# EAGLE design UWB-Breakout (EAGLE 9.6.1)
CNAME: DWM1000 Breakout; CREVISION: 1.0; DESIGNER: Jedidiah Hodson
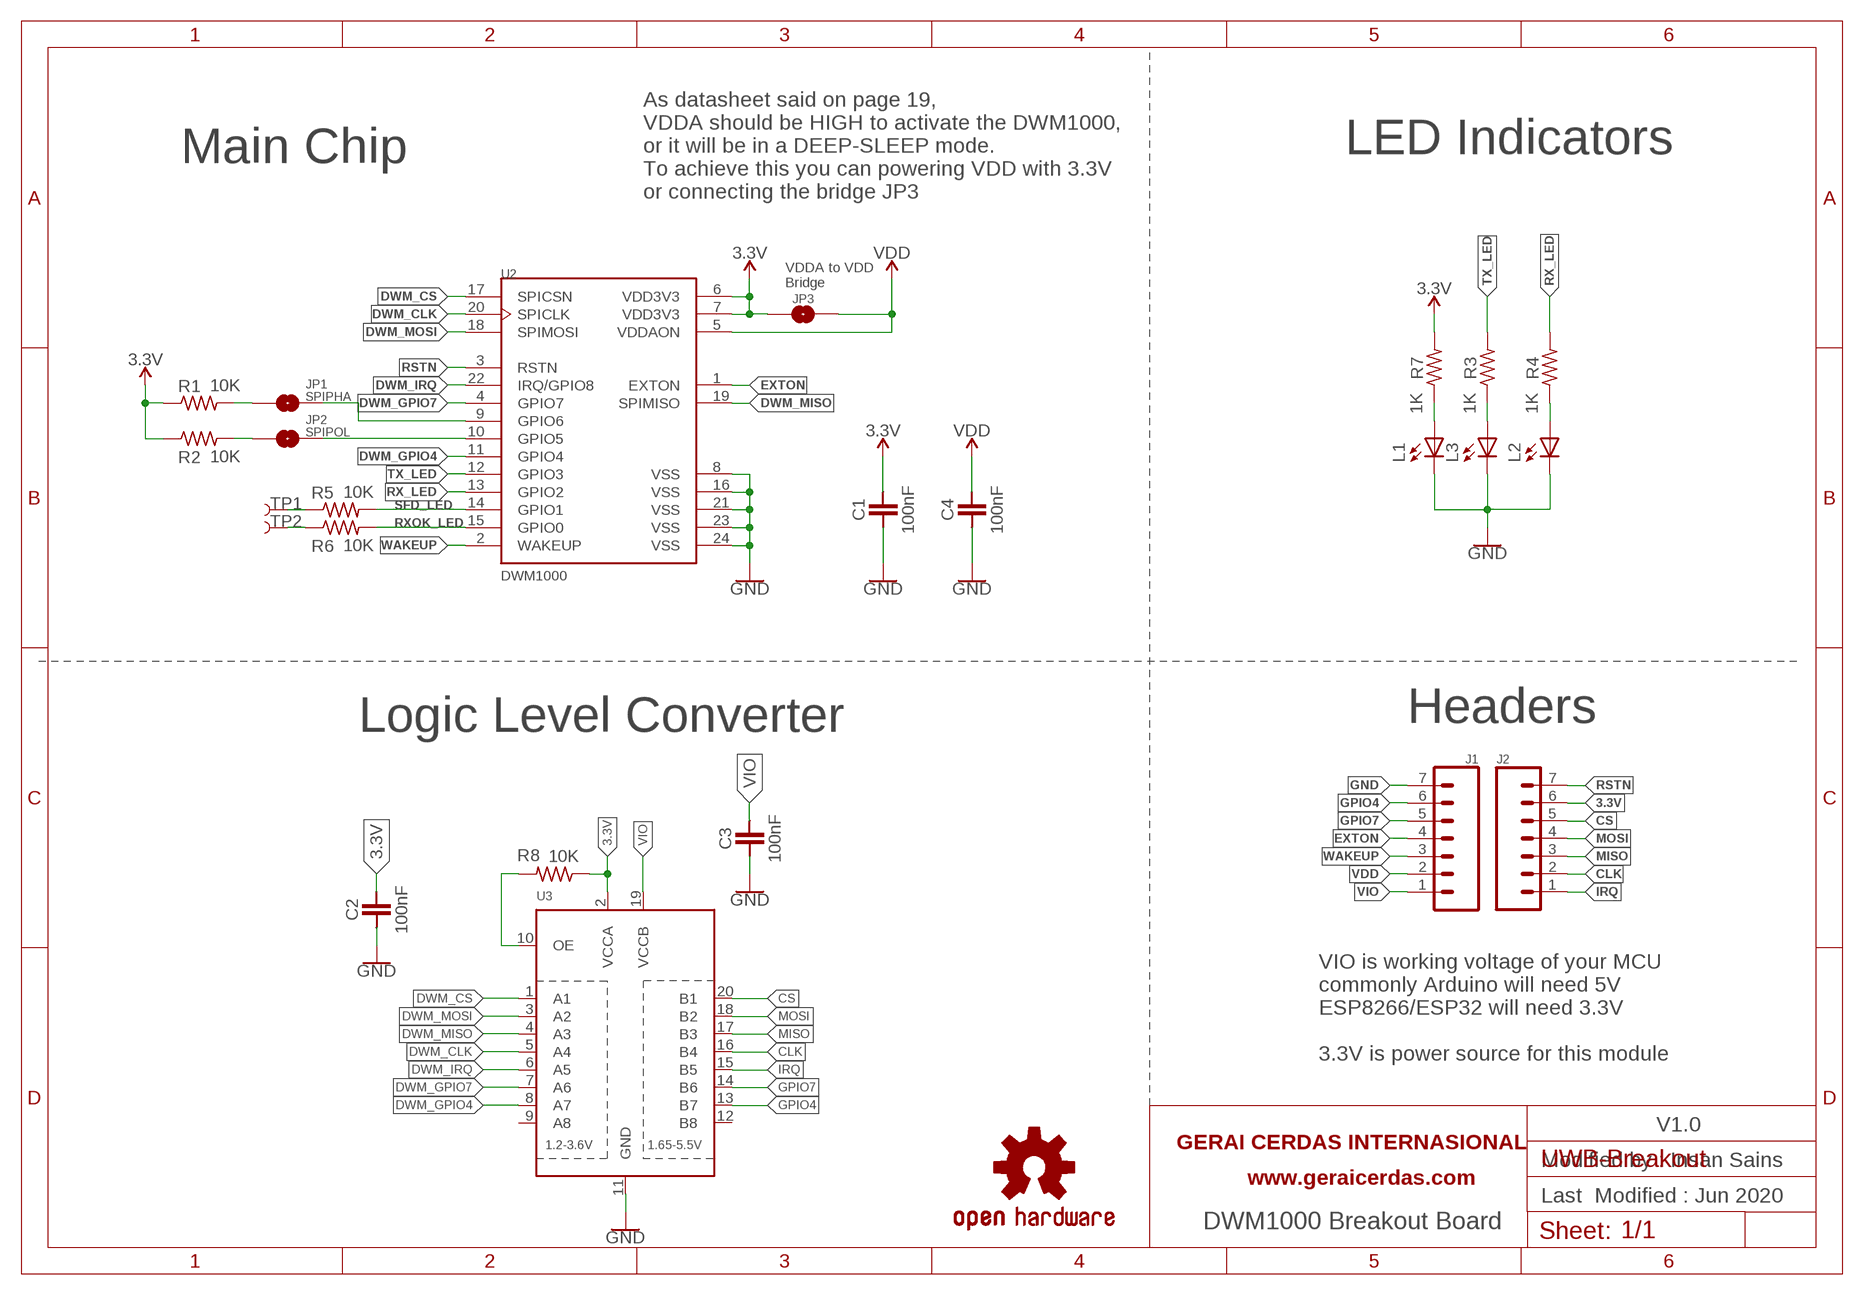
[diagram p0: schematic, sheet 1]

## Parts
C1  100nF  CAPACITOR-SMD0603  [C0603]
C2  100nF  CAPACITOR-SMD0603  [C0603]
C3  100nF  CAPACITOR-SMD0603  [C0603]
C4  100nF  CAPACITOR-SMD0603  [C0603]
FRAME1  FRAME  [A4-HOR]
J1  CONN_07NO_SILK  [1X07_NO_SILK]
J2  CONN_07NO_SILK  [1X07_NO_SILK]
JP1  SPIPHA  JUMPER-SMT_2_NO_SILK  [SMT-JUMPER_2_NO_SILK]
JP2  SPIPOL  JUMPER-SMT_2_NO_SILK  [SMT-JUMPER_2_NO_SILK]
JP3  JUMPER-SMT_2_NO_SILK  [SMT-JUMPER_2_NO_SILK]
L1  LED-SMD0805  [LED0805]
L2  LED-SMD0805  [LED0805]
L3  LED-SMD0805  [LED0805]
LOGO1  OSHW-LOGOM  [OSHW-LOGO-M]
R1  10K  RESISTOR-SMD0603  [R0603]
R2  10K  RESISTOR-SMD0603  [R0603]
R3  1K  RESISTOR-SMD0603  [R0603]
R4  1K  RESISTOR-SMD0603  [R0603]
R5  10K  RESISTOR-SMD0603  [R0603]
R6  10K  RESISTOR-SMD0603  [R0603]
R7  1K  RESISTOR-SMD0603  [R0603]
R8  10K  RESISTOR-SMD0603  [R0603]
TP1  TEST-POINT3X5  [PAD.03X.05]
TP2  TEST-POINT3X5  [PAD.03X.05]
U2  DWM1000  [XCVR_DWM1000]
U3  TXB0108PWR  [TSSOP20]

## Nets
3.3V: C1.2 C2.2 J2.6 JP3.1 R1.1 R2.1 R7.2 R8.1 U2.6(VDD3V3) U2.7(VDD3V3) U3.2(VCCA)
CLK: J2.2 U3.16(B4)
CS: J2.5 U3.20(B1)
DWM_CLK: U2.20(SPICLK) U3.5(A4)
DWM_CS: U2.17(SPICSN) U3.1(A1)
DWM_GPIO4: U2.11(GPIO4) U3.8(A7)
DWM_GPIO7: U2.4(GPIO7) U3.7(A6)
DWM_IRQ: U2.22(IRQ/GPIO8) U3.6(A5)
DWM_MISO: U2.19(SPIMISO) U3.4(A3)
DWM_MOSI: U2.18(SPIMOSI) U3.3(A2)
EXTON: J1.4 U2.1(EXTON)
GND: C1.1 C2.1 C3.1 C4.1 J1.7 L1.C L2.C L3.C U2.8(VSS) U2.16(VSS) U2.21(VSS) U2.23(VSS) U2.24(VSS) U3.11(GND)
GPIO4: J1.6 U3.13(B7)
GPIO7: J1.5 U3.14(B6)
IRQ: J2.1 U3.15(B5)
MISO: J2.3 U3.17(B3)
MOSI: J2.4 U3.18(B2)
N$1: L1.A R7.1
N$2: L3.A R3.1
N$3: JP1.2 U2.9(GPIO6)
N$4: JP2.2 U2.10(GPIO5)
N$5: JP1.1 R1.2
N$6: JP2.1 R2.2
N$7: R6.1 TP2.P$1
N$8: R5.1 TP1.P$1
N$9: L2.A R4.1
N$10: R8.2 U3.10(OE)
RSTN: J2.7 U2.3(RSTN)
RX_LED: R4.2 U2.13(GPIO2)
RXOK_LED: R6.2 U2.15(GPIO0)
SFD_LED: R5.2 U2.14(GPIO1)
TX_LED: R3.2 U2.12(GPIO3)
VDD: C4.2 J1.2 JP3.2 U2.5(VDDAON)
VIO: C3.2 J1.1 U3.19(VCCB)
WAKEUP: J1.3 U2.2(WAKEUP)
Unconnected: U3.9(A8) U3.12(B8)

## Notes on the sheet
- Main Chip | LED Indicators
- As datasheet said on page 19, 
  VDDA should be HIGH to activate the DWM1000,
  or it will be in a DEEP-SLEEP mode.
  To achieve this you can powering VDD with 3.3V
  or connecting the bridge JP3
- VDDA to VDD
  Bridge
- Logic Level Converter | Headers
- VIO is working voltage of your MCU
  commonly Arduino will need 5V
  ESP8266/ESP32 will need 3.3V
  
  3.3V is power source for this module
- V1.0
- Modified by : Insan Sains
- Last  Modified : Jun 2020
- DWM1000 Breakout Board

## Library data of the parts
C1-C4 = geraicerdas:CAPACITOR
FRAME1 = geraicerdas:FRAME
J1 J2 = SparkFun-Connectors:CONN_07: Multi connection point. Often used as Generic Header-pin footprint for 0.1 inch spaced/style header connections On any of the 0.1 inch spaced packages, you can populate with these: Break Away Headers - Straight <https://www.sparkfun.com/products/116> (PRT-00116) Break Away Male Headers - Right Angle <https://www.sparkfun.com/products/553> (PRT-00553) Female Headers <https://www.sparkfun.com/products/115> (PRT-00115) Break Away Headers - Machine Pin <https://www.sparkfun.com/products/117> (PRT-00117) Break Away Female Headers - Swiss Machine Pin <https://www.sparkfun.com/products/743> (PRT-00743) For SCREWTERMINALS and SPRING TERMINALS visit here: Screw Terimnals on SparkFun.com <https://www.sparkfun.com/search/results?term=Screw+Terminals> (5mm/3.5mm/2.54mm spacing) This device is also useful as a general connection point to wire up your design to another part of your project. Our various solder wires solder well into these plated through hole pads. Hook-Up Wire - Assortment (Stranded, 22 AWG) <https://www.sparkfun.com/products/11375> (PRT-11375) Hook-Up Wire - Assortment (Solid Core, 22 AWG) <https://www.sparkfun.com/products/11367> (PRT-11367) View the entire wire category on our website here <https://www.sparkfun.com/categories/141> Special notes: Molex polarized connector foot print use with SKU : PRT-08231 with associated crimp pins and housings. 1MM SMD Version SKU: PRT-10208 NOTES ON THE VARIANTS LOCK and LOCK_LONGPADS... This footprint was designed to help hold the alignment of a through-hole component (i.e. 6-pin header) while soldering it into place. You may notice that each hole has been shifted either up or down by 0.005 of an inch from it's more standard position (which is a perfectly straight line). This slight alteration caused the pins (the squares in the middle) to touch the edges of the holes. Because they are alternating, it causes a "brace" to hold the component in place. 0.005 has proven to be the perfect amount of "off-center" position when using our standard breakaway headers. Although looks a little odd when you look at the bare footprint, once you have a header in there, the alteration is very hard to notice. Also,if you push a header all the way into place, it is covered up entirely on the bottom side.
JP1-JP3 = SparkFun-Jumpers:JUMPER-SMT_2_NO: Normally open jumper This jumper has two pads in close proximity to each other. Apply solder to close the connection. Round pads are easier to solder for beginners, but are a lot larger. SparkFun Product that uses the round pads: SparkFun EL Sequencer <https://www.sparkfun.com/products/12781>
L1-L3 = geraicerdas:LED
LOGO1 = SparkFun-Aesthetics:OSHW-LOGO: Open-Source Hardware (OSHW) Logo This logo indicates the piece of hardware it is found on incorporates a OSHW license and/or adheres to the definition of open source hardware found here: http://freedomdefined.org/OSHW
R1-R8 = geraicerdas:RESISTOR
TP1 TP2 = SparkFun-Connectors:TEST-POINT: SparkFun Test Points Bare copper test points for troubleshooting or In-Circuit-Testing. These are used by our Production team for verifying production board runs using pogo-pins on test beds. SparkFun Products: SparkFun LSM9DS1 Breakout <https://www.sparkfun.com/products/13284> SparkFun PSOC <https://www.sparkfun.com/products/13714> SparkFun Load Cell Amplifier <https://www.sparkfun.com/products/13879>
U2 = DWM1000:DWM1000: Mod Ieee802.15.4-2011 Uwb Txrx; AVAILABILITY: Unavailable; DESCRIPTION: Mod Ieee802.15.4-2011 Uwb Txrx; MF: Decawave Limited; MP: DWM1000; PACKAGE: Module Decawave; PRICE: None
U3 = geraicerdas:TXB0108: 8-Bit Bi-Directional Level Shifter 1.2V-3.6V (VCCA) to 1.65V-5.5V (VCCB) bi-directional level shifter with auto direction sensing. Max data rate - VCCA 1.8V: 20Mbps (50ns), VCCA 3.3V: 100Mbps (10ns) Digikey: 296-21527-1-ND

## Board
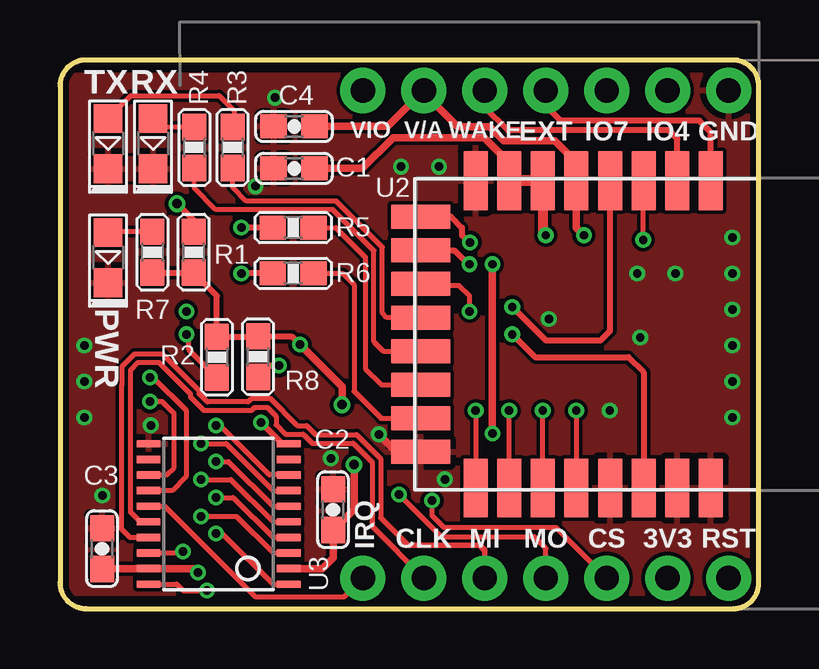
[diagram p1: board, top side]
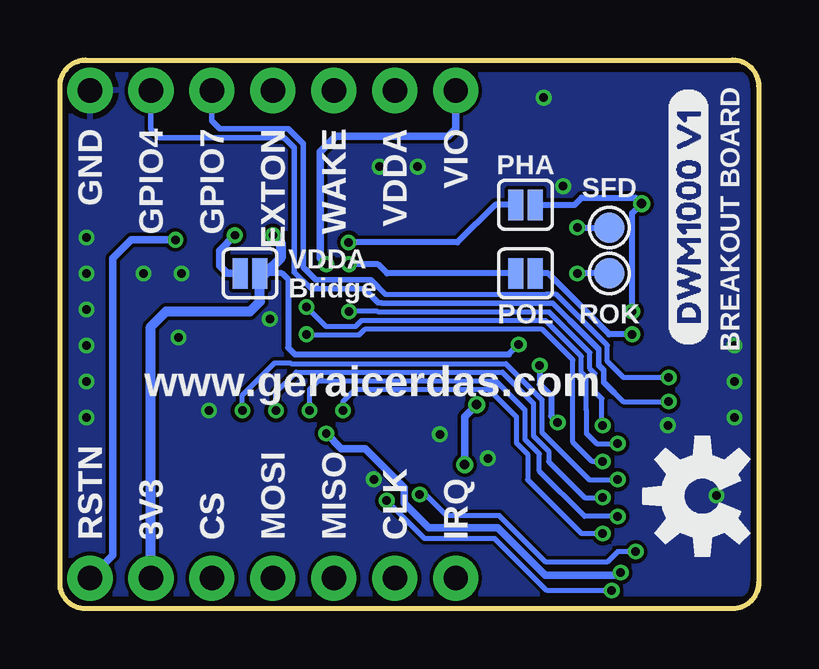
[diagram p2: board, bottom side, seen from below]

Size 29.11 x 22.86 mm. Coordinates in mm from the lower left corner, seen from the top.
Outline: 28.05,22.86 1.08,22.86 arc90 0,21.78 0,1.08 arc90 1.08,0 28.06,0 arc90 29.11,1.05 29.11,21.78 arc90 28.05,22.86
Copper layers (1*16): Top 0.035mm / dielectric 1.5mm / Bottom 0.035mm
Design rules "GeraiCerdas_DRU": minimum track width 6mil, minimum drill 12mil, track to track 6mil, track to pad 6mil, pad to pad 6mil, via to via 6mil, smd to smd 0mil, copper to edge 10mil, drill to drill 10mil, minimum pad ring 10mil, minimum via ring 6mil, stop-mask expansion 2mil, vias tented up to drill 100mil, thermal gap 10mil

### Footprints (pad centres in the part's own frame; a part is rotated, then mirrored left to right if it is on the bottom)
C0603 = smd 1.1 x 1: 1 -0.85,0; 2 0.85,0
1X07_NO_SILK = drill 1.016 pad 1.88: 1 0,0; 2 2.54,0; 3 5.08,0; 4 7.62,0; 5 10.16,0; 6 12.7,0; 7 15.24,0
SMT-JUMPER_2_NO_SILK = smd 0.635 x 1.27: 1 -0.406,0; 2 0.406,0
LED0805 = smd 1.2 x 1.2: A 0,-1.05; C 0,1.05
R0603 = smd 1.1 x 1: 1 -0.85,0; 2 0.85,0
PAD.03X.05 = smd 1.27 x 1.27: P$1 0,0
XCVR_DWM1000 = smd 2.45 x 1: 1 -6.4,1.8; 2 -6.4,0.4; 3 -6.4,-1; 4 -6.4,-2.4; 5 -6.4,-3.8; 6 -6.4,-5.2; 7 -6.4,-6.6; 8 -6.4,-8; 17 6.4,-8; 18 6.4,-6.6; 19 6.4,-5.2; 20 6.4,-3.8; 21 6.4,-2.4; 22 6.4,-1; 23 6.4,0.4; 24 6.4,1.8 | smd 1 x 2.45: 9 -4.9,-10.295; 10 -3.5,-10.295; 11 -2.1,-10.295; 12 -0.7,-10.295; 13 0.7,-10.295; 14 2.1,-10.295; 15 3.5,-10.295; 16 4.9,-10.295
TSSOP20 = smd 0.305 x 0.991: 1 -2.925,-2.918; 2 -2.275,-2.918; 3 -1.625,-2.918; 4 -0.975,-2.918; 5 -0.325,-2.918; 6 0.325,-2.918; 7 0.975,-2.918; 8 1.625,-2.918; 9 2.275,-2.918; 10 2.925,-2.918; 11 2.925,2.918; 12 2.275,2.918; 13 1.625,2.918; 14 0.975,2.918; 15 0.325,2.918; 16 -0.325,2.918; 17 -0.975,2.918; 18 -1.625,2.918; 19 -2.275,2.918; 20 -2.925,2.918

### Placement (x,y rotation side)
C1  100n  [C0603]  9.75,18.34 0 top
C2  100n  [C0603]  11.38,4.12 270 top
C3  100n  [C0603]  1.75,2.5 270 top
C4  100n  [C0603]  9.75,20.09 0 top
FRAME1  -0.19,0 0 top
J1  12.62,21.59 0 top
J2  12.62,1.27 0 top
JP1  9.71,16.83 180 bottom
JP2  9.71,13.97 180 bottom
JP3  21.19,13.97 180 bottom
L1  2,14.62 180 top
L2  3.88,19.38 180 top
L3  2,19.38 180 top
LOGO1  2.35,4.69 90 bottom
R1  5K1  [R0603]  5.57,14.85 90 top
R2  5K1  [R0603]  6.54,10.48 270 top
R3  7.19,19.21 270 top
R4  5.59,19.21 270 top
R5  5K1  [R0603]  9.71,15.88 0 top
R6  5K1  [R0603]  9.71,13.97 0 top
R7  3.85,14.85 270 top
R8  [R0603]  8.25,10.5 270 top
TP1  6.22,15.88 0 bottom
TP2  6.22,13.97 0 bottom
U2  25.32,11.43 270 top
U3  6.61,3.94 90 top
U$1  [DWM1000_V10]  2.92,10.94 90 bottom

### Tracks (layer width: path | path; a pad name or v marks a point on that pad's centre or on a via)
3.3V  (via drill 0.35, 0.4)
  Top 0.254: R7.2 R1.1 6.54,13.03 R2.1 8.23,11.33 | 8.23,11.33 R8.1 | v10,11 9.67,11.33 8.23,11.33
  Top 0.305: U3.2 10.92,1.67 11.38,2.12 C2.2 12.25,4.15 v12.25,6 | 18.88,17.83 18.75,17.95 18.75,18.62 18.62,18.75 18.56,18.75 17.68,19.62 13.88,19.62 12.59,18.34 C1.2 | v11.75,8.5 11.75,9.25 v10,11
  Top 0.406: U2.6 20.12,15.68 v20.24,15.56
  Top 0.457: U2.6 18.88,17.83 U2.7
  Bottom 0.254: 20.56,13.97 19.86,13.97 19.61,13.72 19.61,10.88 19.32,10.59 10.41,10.59 v10,11
  Bottom 0.305: v12.25,6 12.25,8 v11.75,8.5
  Bottom 0.406: v20.24,15.56 19.92,15.24 19.92,14.61 20.56,13.97 JP3.1 20.79,12.79 21.19,12.38 24.68,12.38 25.32,11.75 J2.6
CLK
  Top 0.203: 15.16,1.34 J2.2 13,3.43 13,3.62 13,6.1 12.21,6.9 10.51,6.9 10.13,7.28 9.39,7.28 9.01,7.66 9.01,8.01 8.64,8.38 8.11,8.38 7.99,8.26 6,8.26 5.43,8.82 5.43,8.95 4.12,10.26 3.26,10.26 2.94,9.94 2.94,4.01 3.33,3.62 U3.16
CS  (via drill 0.35)
  Top 0.203: J2.5 20.68,3.38 16,3.38 15.5,3.88 v15.5,4.5 | U3.20 4.86,1.02 5.12,0.75 v6.12,0.75
  Bottom 0.203: v15.5,4.5 13.92,2.92 10.99,2.92 8.83,0.75 v6.12,0.75
DWM_CLK  (via drill 0.35)
  Top 0.203: v21.51,8.26 21.52,8.24 U2.20 | U3.5 8.88,3.62 7.12,5.38 v5.88,5.38
  Bottom 0.203: v21.51,8.26 21.51,8.89 20.16,10.24 19.51,10.24 19.48,10.21 10.53,10.21 9.03,8.71 9.03,7.34 7.06,5.38 v5.88,5.38
DWM_CS  (via drill 0.35)
  Top 0.203: v17.32,8.26 U2.17 | U3.1 8.88,1.02 6.77,3.12 v6.5,3.12
  Bottom 0.203: v17.32,8.26 17.32,8.64 16.81,9.14 11.24,9.14 10.1,8 10.1,6.9 9.62,6.43 9.62,5.38 7.38,3.12 v6.5,3.12
DWM_GPIO4  (via drill 0.35)
  Top 0.203: U2.11 15.09,13.46 16.62,13.46 17.06,13.02 v17.06,12.38 | U3.8 8.73,5.57 6.67,7.62 v6.5,7.62
  Bottom 0.203: v6.5,7.62 6.51,7.63 6.54,7.63 6.54,8.75 6.82,9.04 6.82,9.79 7.03,10 7.03,10.66 8.72,12.35 15.84,12.35 15.87,12.38 v17.06,12.38
DWM_GPIO7  (via drill 0.35)
  Top 0.203: U3.7 8.88,4.92 6.92,6.88 v5.88,6.88
  Top 0.254: v18.84,12.57 20.24,11.18 22.53,11.18 22.92,11.57 U2.4
  Bottom 0.203: 7.17,8.26 7.17,8.27 | 7.17,8.27 7.17,7.3 6.75,6.88 v5.88,6.88 | 7.17,8.27 7.17,9.64 7.39,9.85 7.39,10.52 8.87,12 16.56,12 16.8,11.75 18.02,11.75 v18.84,12.57
DWM_IRQ  (via drill 0.35)
  Top 0.203: U3.6 8.88,4.27 7.02,6.12 v6.5,6.12
  Top 0.254: v18.84,11.43 19.8,10.48 23.68,10.48 24.32,9.84 U2.22
  Bottom 0.203: v6.5,6.12 6.93,6.12 7.74,6.94 7.74,10.37 9.02,11.64 16.41,11.64 16.66,11.39 18.81,11.39 v18.84,11.43
DWM_MISO  (via drill 0.35)
  Top 0.203: U2.19 20.12,8.25 v20.11,8.26 | U3.4 8.88,2.97 7.22,4.62 v6.5,4.62
  Bottom 0.203: v20.11,8.26 20.11,9.02 19.27,9.86 10.68,9.86 9.39,8.56 9.39,7.2 8.75,6.56 8.75,6.12 7.25,4.62 v6.5,4.62
DWM_MOSI  (via drill 0.35)
  Top 0.203: U2.18 v18.72,8.25 v18.72,8.26 | U3.3 8.88,2.32 7.35,3.84 v5.88,3.84
  Bottom 0.203: v18.72,8.26 18.72,9.14 18.36,9.5 10.96,9.5 9.74,8.28 9.74,7.05 9.14,6.45 9.14,5.73 7.25,3.84 v5.88,3.84
EXTON
  Top 0.254: U2.1 27.12,19.85 26.64,20.33 20.86,20.33 20.24,20.95 J1.4
GND  (via drill 0.35)
  Top 0.305: U2.16 14.02,6.53 v13.29,7.26
  other vias: 16.04,5.39 24.05,13.97 25.64,13.97 20.37,12.06 22.91,8.26 24.18,11.3 14.21,18.41 15.79,18.41 3.79,7.64 11.29,6.26 8.96,21.29 8.14,17.6 28.01,13.97 28.01,12.47 28.01,10.97 28.01,9.47 28.01,7.97 28.01,15.47 1.01,7.97 1.01,9.47 1.01,10.97 1.76,4.72
  pour Top: 0.43,22.23 28.86,22.23 28.86,0.64 0.43,0.64
  pour Bottom: 0.43,22.23 28.86,22.23 28.86,0.64 0.43,0.64
GPIO4  (via drill 0.35)
  Top 0.203: U3.13 4.44,5.57 4.75,5.88 4.75,8.12 4.25,8.62 v3.75,8.62
  Bottom 0.203: 6.01,8.99 5.64,8.62 v3.75,8.62 | 8.58,12.72 7.86,12.01
  Bottom 0.221: J1.6 25.32,20 24.95,19.63 19.76,19.63 19.34,19.21 19.34,14.03 18.65,13.34 16.43,13.34 15.84,12.75 15.72,12.75 15.69,12.72 8.73,12.72 8.58,12.72 | 6.01,8.99 6.46,9.44 6.46,9.94 6.67,10.15 6.67,10.81 7.86,12.01
GPIO7  (via drill 0.35)
  Top 0.203: v3.75,9.62 3.89,9.62 5.26,8.26 5.26,5.51 4.67,4.92 U3.14
  Bottom 0.203: v3.75,9.62 5.62,9.62 6.3,10.3 6.3,10.96 8.43,13.09 8.88,13.09 8.89,13.08 15.54,13.08 15.86,13.39
  Bottom 0.221: 15.86,13.39 16.17,13.71 18.46,13.71 18.97,14.22 18.97,19.37 19.61,20 22.46,20 22.78,20.32 J1.5
IRQ
  Top 0.203: U3.15 4.36,4.27 8.12,0.5 11.85,0.5 J2.1
MISO
  Top 0.203: U3.17 2.91,2.97 2.56,3.31 2.56,9.29 2.59,9.32 2.59,10.09 3.11,10.61 4.26,10.61 5.79,9.09 5.79,8.97 6.14,8.61 7.84,8.61 7.97,8.74 8.78,8.74 9.89,7.63 10.28,7.63 10.65,7.25 12.36,7.25 13.36,6.25 13.36,3.78 14.51,2.64
  Top 0.221: J2.3 17.7,2.43 17.49,2.64 14.51,2.64
MOSI  (via drill 0.35)
  Top 0.203: J2.4 20.24,2.51 19.75,3 15.88,3 v14.12,4.75 | U3.18 5.07,2.32 v5.12,2.38
  Bottom 0.203: v5.12,2.38 5.88,2.38 6.31,1.94 8.87,1.94 10.8,3.88 13,3.88 13.88,4.75 v14.12,4.75
N$1
  Top 0.203: R7.1 2.03,15.7 L1.A
N$2
  Top 0.203: L3.A 2.95,21.38 6.62,21.38 7.25,20.75 7.25,20.12 R3.1
N$3  (via drill 0.35)
  Top 0.254: U2.9 16.29,16.33 16.75,15.88 16.75,15.56 17.05,15.26 v17.09,15.26
  Bottom 0.254: JP1.2 10.98,16.83 12.55,15.26 v17.09,15.26 17.05,15.26
N$4  (via drill 0.35)
  Top 0.254: U2.10 16.42,14.93 17,14.35 v17.06,14.35
  Bottom 0.254: JP2.2 15.48,13.97 15.86,14.35 v17.06,14.35
N$5  (via drill 0.35, 0.4)
  Top 0.254: v4.88,16.88 5.57,16.18 R1.2
  Bottom 0.254: v5.27,12.38 5.27,16.48 v4.88,16.88 5.12,17.12 7.38,17.12 7.67,16.83 JP1.1
N$6  (via drill 0.35)
  Top 0.203: v5.27,11.43 5.37,11.33 5.37,10.79 R2.2
  Bottom 0.254: v5.27,11.43 6.23,11.43 8.77,13.97 JP2.1
N$7  (via drill 0.35)
  Top 0.254: R6.1 v7.56,13.97
  Bottom 0.254: TP2.P$1 v7.56,13.97
N$8  (via drill 0.35)
  Top 0.254: R5.1 v7.56,15.88
  Bottom 0.254: v7.56,15.88 TP1.P$1
N$9
  Top 0.203: R4.1 4.24,20.07 L2.A
N$10  (via drill 0.35)
  Top 0.254: R8.2 8.72,10.12 v9.12,10.12 | v8.38,7.75 9.26,6.87 U3.10
  Bottom 0.254: v9.12,10.12 9.12,9.34 8.65,8.87 8.65,8.03 v8.38,7.75
RSTN  (via drill 0.35)
  Top 0.203: v24.3,15.37 24.3,17.81 U2.3
  Bottom 0.305: J2.7 26.91,2.22 26.91,14.61 26.14,15.37 v24.3,15.37
RX_LED
  Top 0.203: R4.2 5.59,17.53 6.5,16.63 11.37,16.63 13.08,14.92 13.08,11.12 13.47,10.73 U2.13
RXOK_LED
  Top 0.203: U2.15 13.38,7.93 12.25,9.05 12.25,13.5 11.78,13.97 R6.2
SFD_LED
  Top 0.203: U2.14 13.38,9.33 13.38,9.35 12.72,10 12.72,14.64 11.49,15.88 R5.2
TX_LED
  Top 0.203: U2.12 13.62,12.13 13.44,12.32 13.44,15.06 11.52,16.98 7.77,16.98 7.19,17.56 R3.2
VDD  (via drill 0.35)
  Top 0.254: U2.5 21.51,18.38 | 15.16,21.5 J1.2
  Top 0.305: U2.5 21.52,15.87 v21.83,15.56 | 21.51,18.38 21.51,18.6 20.61,19.49 18.49,19.49 17.9,20.08 16.58,20.08 15.16,21.5 | C4.2 13.66,20.09 J1.2
  Bottom 0.305: v21.83,15.56 22.46,14.92 22.46,14.29 22.14,13.97 JP3.2
VIO  (via drill 0.35)
  Top 0.254: 1.77,1.67 C3.2
  Top 0.305: 1.77,1.67 U3.19 5.58,1.67 v5.75,1.5 | v18.02,14.35 v18.02,7.3
  Bottom 0.254: 12.62,21.38 J1.1
  Bottom 0.305: v5.75,1.5 5.87,1.38 8.88,1.38 10.88,3.37 13.75,3.37 14.76,4.38 14.76,5.04 16.38,6.67 17.38,6.67 v18.02,7.3 | v18.02,14.35 18.27,14.61 18.27,19.04 17.62,19.68 12.94,19.68 12.62,20 12.62,21.38
WAKEUP
  Top 0.254: U2.2 25.72,19.58 25.37,19.93 18.67,19.93 17.7,20.9 J1.3

### Text on the board
tPlace: TX | RX | VIO | V/A | WAKE | EXT | IO7 | IO4 | GND | PWR | IRQ | CLK | MI | MO | CS | 3V3 | RST
bPlace: VIO | VDDA | WAKE | WAKE | EXTON | EXTON | GPIO7 | GPIO4 | GND | PHA | SFD | BREAKOUT BOARD | VDDA / Bridge | ROK | POL | www.geraicerdas.com | IRQ | CLK | CLK | MISO | MOSI | CS | CS | 3V3 | RSTN | RSTN